# Altium project project.PrjPcb
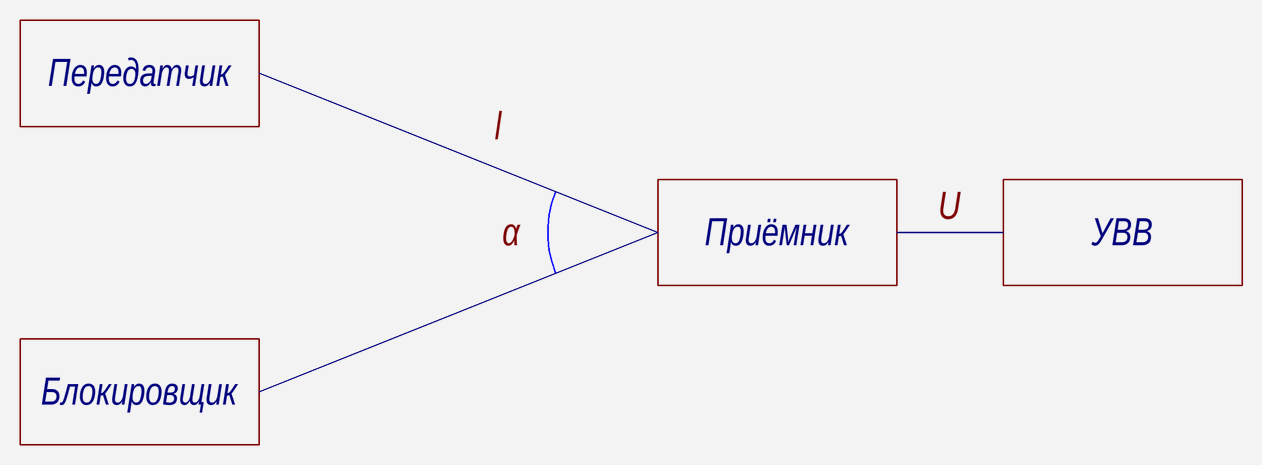
[diagram p0: structure.SchDoc]
3 sheets, 15 parts. Net scope: global (net labels, ports and power ports of the same name join across sheets).
Sheets:
  structure.SchDoc
  principal_input.SchDoc
  principal_output.SchDoc

## Sheet structure.SchDoc
size 420 x 297 mm

### Notes on the sheet
- Передатчик
- l
- α
- Приёмник
- U
- УВВ
- Блокировщик
- Перв. примен.
- Справ. №
- Подп. и дата
- Инв. № дубл.
- Взам. инв. №
- Разраб.
- Изм.
- Лист
- № докум.
- Подп.
- Дата
- Лит.
- Масса
- Масштаб
- Пров.
- Т. контр.
- Листов
- Инв. № подл.
- Н. контр.
- Утв.
- Копировал
- Формат А3

## Sheet principal_input.SchDoc
size 420 x 297 mm
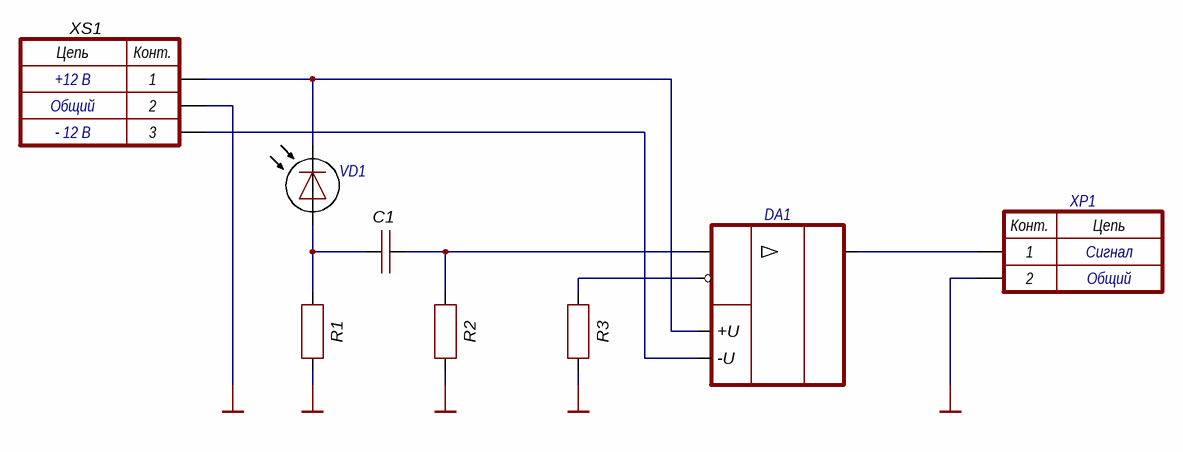
[diagram p1: principal_input.SchDoc]

### Parts
(Parts that share a designator on the sheet are numbered #1, #2 ... from top to bottom, then left to right.)
C1  C  [C_1206]  (value not drawn)
DA1  OU  (value not drawn)
R1#1  R  [R_1206]  (value not drawn)
R2#1  R  [R_1206]  (value not drawn)
R3  R  [R_1206]  (value not drawn)
VD1#1  VD  (value not drawn)
XP1#1  X_2  (value not drawn)
XS1  X_3  [PCBComponent_1]  (value not drawn)

### Nets
GND: R1#1.2 R2#1.2 R3.2 XP1#1.2 XS1.2
NetC1_1: C1.1 R1#1.1 VD1#1.1(A)
NetC1_2: C1.2 DA1.1 R2#1.1
NetDA1_2: DA1.2 R3.1
NetDA1_3: DA1.3(+U) VD1#1.2(C) XS1.1
NetDA1_4: DA1.4(-U) XS1.3
NetDA1_5: DA1.5 XP1#1.1

### Notes on the sheet
- +12 В
- - 12 В
- Общий
- Сигнал
- Перв. примен.
- Справ. №
- Подп. и дата
- Инв. № дубл.
- Взам. инв. №
- Разраб.
- Изм.
- Лист
- № докум.
- Подп.
- Дата
- Лит.
- Масса
- Масштаб
- Пров.
- Т. контр.
- Листов
- Инв. № подл.
- Н. контр.
- Утв.
- Копировал
- Формат А3
- (in symbol X_2) Конт.; Цепь
- (in symbol X_3) Цепь; Конт.

### Library data of the parts
VD1#1 = photodiode

## Sheet principal_output.SchDoc
size 420 x 297 mm
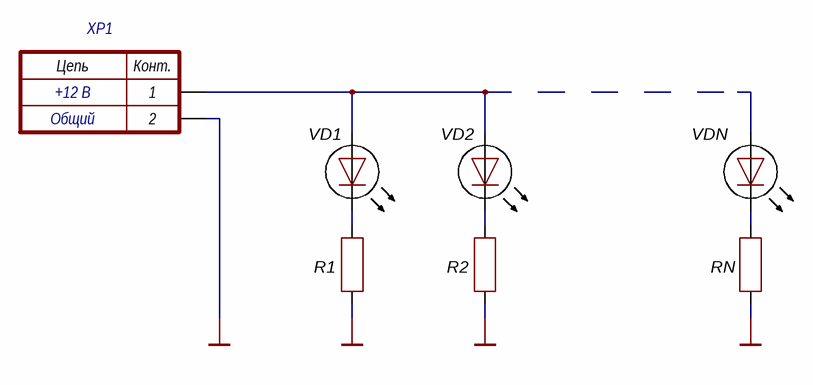
[diagram p2: principal_output.SchDoc]

### Parts
(Parts that share a designator on the sheet are numbered #1, #2 ... from top to bottom, then left to right.)
R1#2  R  [R_1206]  (value not drawn)
R2#2  R  [R_1206]  (value not drawn)
RN  R  [R_1206]  (value not drawn)
VD1#2  LED  (value not drawn)
VD2  LED  (value not drawn)
VDN  LED  (value not drawn)
XP1#2  X_2  (value not drawn)

### Nets
GND: R1#2.1 R2#2.1 RN.1 XP1#2.2
NetR1#2_2: R1#2.2 VD1#2.2(C)
NetR2#2_2: R2#2.2 VD2.2(C)
NetRN_2: RN.2 VDN.2(C)
NetVD1#2_1: VD1#2.1(A) VD2.1(A) XP1#2.1

Not connected (* = marked no-connect by the designer): VDN 1(A)

### Notes on the sheet
- Общий
- +12 В
- Перв. примен.
- Справ. №
- Подп. и дата
- Инв. № дубл.
- Взам. инв. №
- Разраб.
- Изм.
- Лист
- № докум.
- Подп.
- Дата
- Лит.
- Масса
- Масштаб
- Пров.
- Т. контр.
- Листов
- Инв. № подл.
- Н. контр.
- Утв.
- Копировал
- Формат А3
- (in symbol X_2) Цепь; Конт.

## Nets that join several sheets
GND: principal_input (5 pins), principal_output (R1#2.1 R2#2.1 RN.1 XP1#2.2)